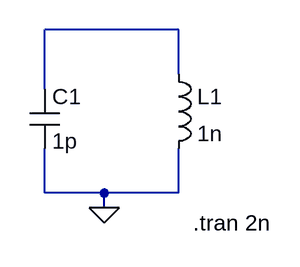
[diagram p0: schematic LC_circuit_1.asc]
LC_circuit_1.asc, the LTspice schematic file:
Version 4
SHEET 1 880 680
WIRE 272 64 128 64
WIRE 272 112 272 64
WIRE 128 128 128 64
WIRE 128 240 128 192
WIRE 192 240 128 240
WIRE 272 240 272 192
WIRE 272 240 192 240
WIRE 192 256 192 240
FLAG 192 256 0
SYMBOL ind 256 96 R0
SYMATTR InstName L1
SYMATTR Value 1n
SYMBOL cap 112 128 R0
SYMATTR InstName C1
SYMATTR Value 1p
TEXT 288 272 Left 2 !.tran 2n

The netlist it stands for:
* LC_circuit_1.asc
L1 N001 0 1n
C1 N001 0 1p
.tran 2n
.backanno
.end